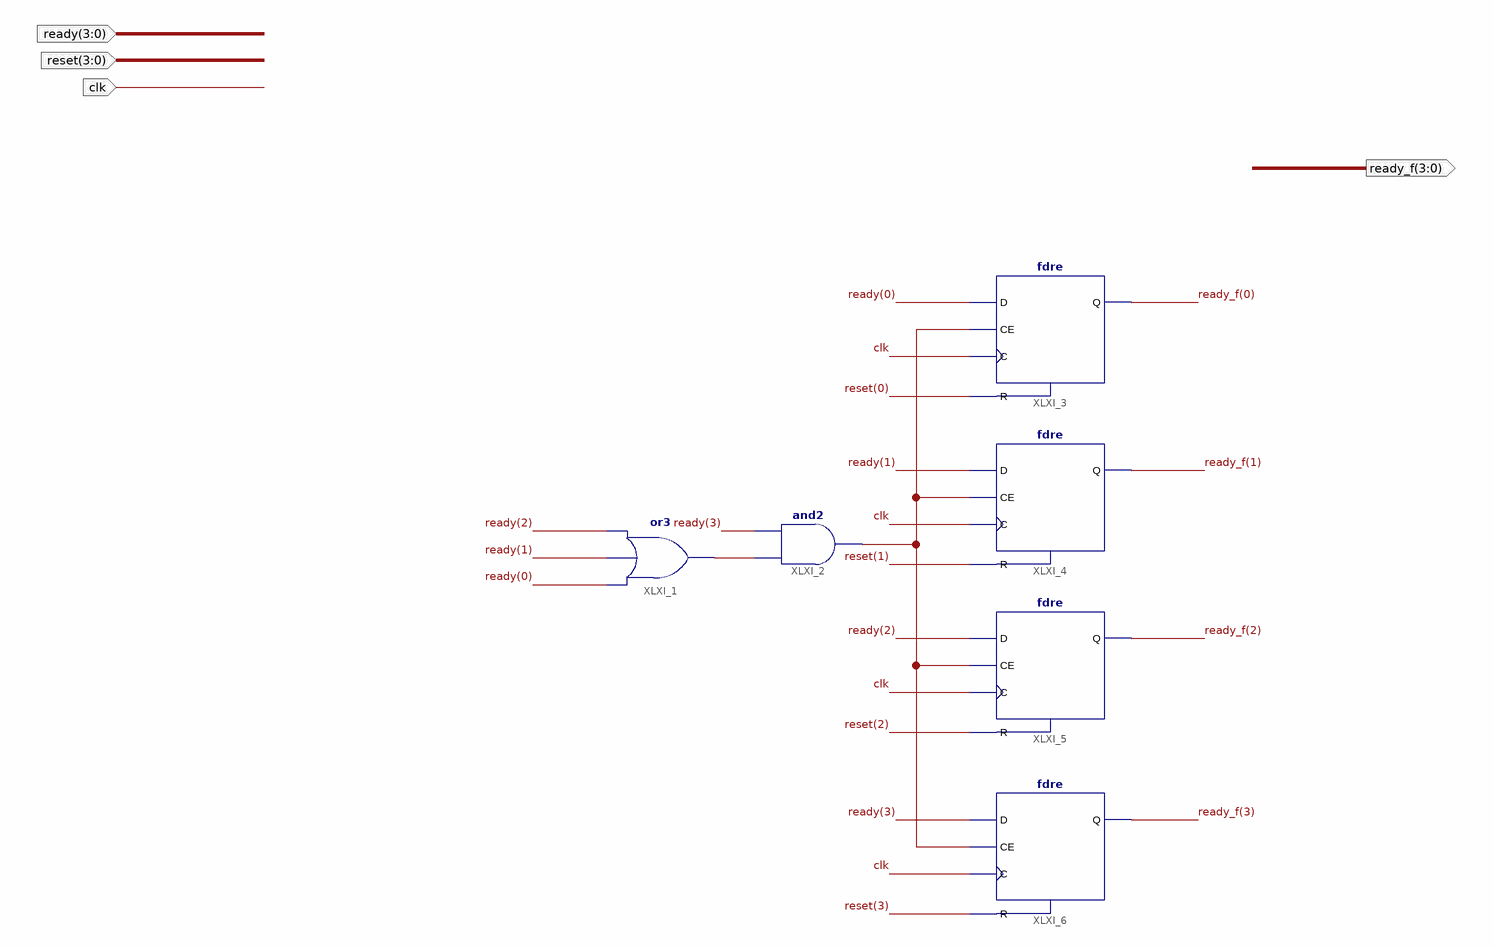
[diagram p0: schematic sheet 1]
// Xilinx ISE schematic data_filter.sch (spartan6) as structural Verilog: 6 symbols, 7 ports
module data_filter (
  input  [3:0] ready,
  input  clk,
  input  [3:0] reset,
  output [3:0] ready_f
);

  wire XLXN_12, XLXN_14;

  or XLXI_1 (XLXN_12, ready[0], ready[1], ready[2]);
  and XLXI_2 (XLXN_14, XLXN_12, ready[3]);
  fdre XLXI_5 (.C(clk), .CE(XLXN_14), .D(ready[2]), .R(reset[2]), .Q(ready_f[2]));
  fdre XLXI_6 (.C(clk), .CE(XLXN_14), .D(ready[3]), .R(reset[3]), .Q(ready_f[3]));
  fdre XLXI_4 (.C(clk), .CE(XLXN_14), .D(ready[1]), .R(reset[1]), .Q(ready_f[1]));
  fdre XLXI_3 (.C(clk), .CE(XLXN_14), .D(ready[0]), .R(reset[0]), .Q(ready_f[0]));
endmodule
